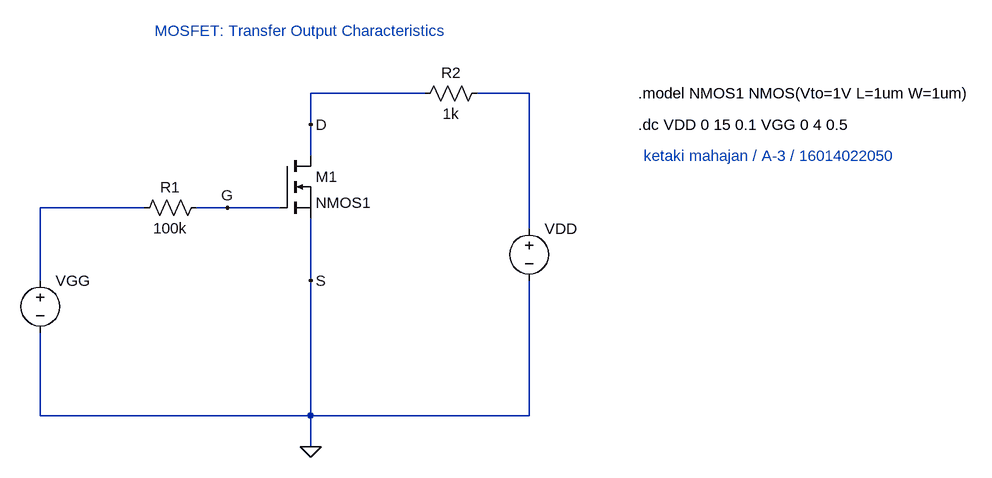
[diagram p0: schematic Draft1.asc]
Draft1.asc, the LTspice schematic file:
Version 4
SHEET 1 1756 680
WIRE 640 -144 464 -144
WIRE 800 -144 720 -144
WIRE 464 -96 464 -144
WIRE 464 -48 464 -96
WIRE 208 32 48 32
WIRE 336 32 288 32
WIRE 416 32 336 32
WIRE 800 64 800 -144
WIRE 48 144 48 32
WIRE 464 144 464 48
WIRE 48 352 48 224
WIRE 464 352 464 144
WIRE 464 352 48 352
WIRE 800 352 800 144
WIRE 800 352 464 352
WIRE 464 400 464 352
FLAG 464 400 0
FLAG 464 144 S
FLAG 464 -96 D
FLAG 336 32 G
SYMBOL voltage 48 128 R0
WINDOW 123 0 0 Left 0
WINDOW 39 0 0 Left 0
SYMATTR InstName VGG
SYMATTR Value ""
SYMBOL res 304 16 R90
WINDOW 0 0 56 VBottom 2
WINDOW 3 32 56 VTop 2
SYMATTR InstName R1
SYMATTR Value 100k
SYMBOL nmos 416 -48 R0
SYMATTR InstName M1
SYMATTR Value NMOS1
SYMBOL res 736 -160 R90
WINDOW 0 0 56 VBottom 2
WINDOW 3 32 56 VTop 2
SYMATTR InstName R2
SYMATTR Value 1k
SYMBOL voltage 800 48 R0
WINDOW 123 0 0 Left 0
WINDOW 39 0 0 Left 0
SYMATTR InstName VDD
SYMATTR Value ""
TEXT 968 -144 Left 2 !.model NMOS1 NMOS(Vto=1V L=1um W=1um)
TEXT 968 -96 Left 2 !.dc VDD 0 15 0.1 VGG 0 4 0.5
TEXT 224 -240 Left 2 ;MOSFET: Transfer Output Characteristics
TEXT 976 -48 Left 2 ;ketaki mahajan / A-3 / 16014022050

The netlist it stands for:
* Draft1.asc
VGG N002 0
R1 G N002 100k
M1 D G 0 0 NMOS1
R2 N001 D 1k
VDD N001 0
.model NMOS NMOS
.model PMOS PMOS
.lib standard.mos
.model NMOS1 NMOS(Vto=1V L=1um W=1um)
.dc VDD 0 15 0.1 VGG 0 4 0.5
* MOSFET: Transfer Output Characteristics
* ketaki mahajan / A-3 / 16014022050
.backanno
.end